# Altium schematic sheet top.SchDoc
size 420 x 297 mm; SheetNumber: 1; SheetTotal: 2
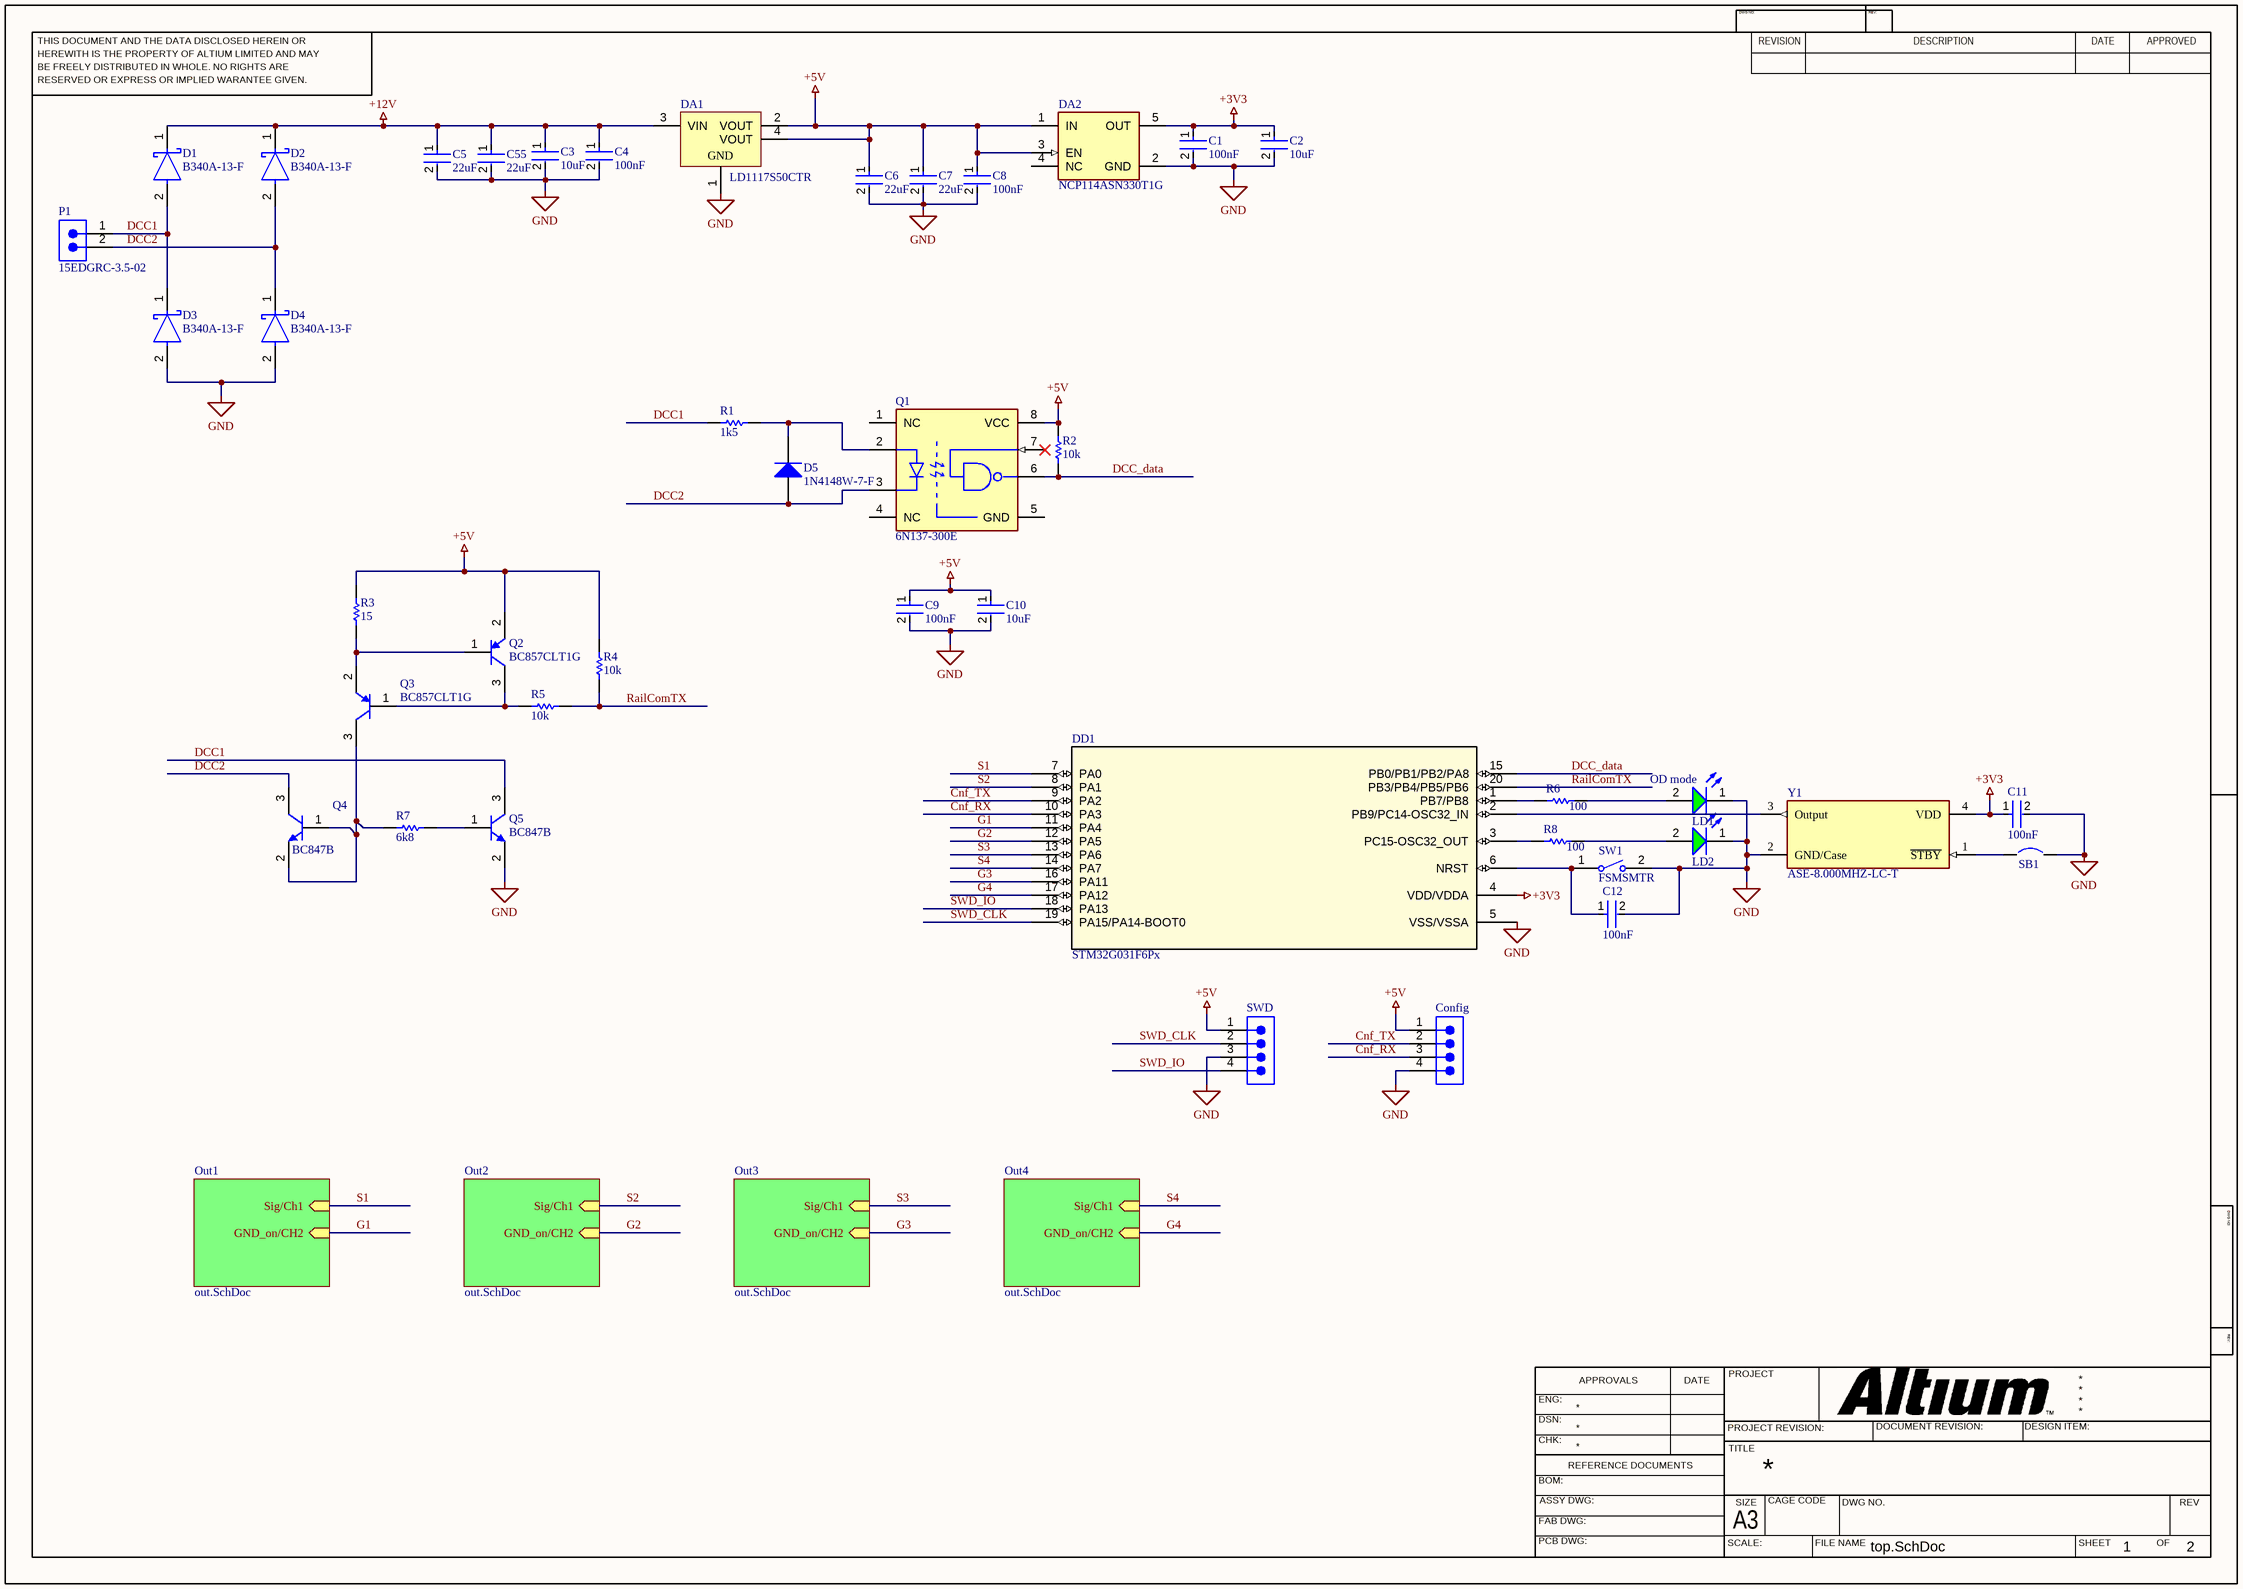
[diagram p0: top.SchDoc]

## Parts
C1  Capacitance: 100nF  [FP-CGA3E-0_3-0_1-IPC_C]  (hidden comment: CGA3E2X7R1H104K080AA)
C2  Capacitance: 10uF  [FP-GRM188-0_1-e0_2_0_55-IPC_C]  (hidden comment: GRM188R60J106ME47D)
C3  Capacitance: 10uF  [FP-GRM188-0_1-e0_2_0_55-IPC_C]  (hidden comment: GRM188R60J106ME47D)
C4  Capacitance: 100nF  [FP-CGA3E-0_3-0_1-IPC_C]  (hidden comment: CGA3E2X7R1H104K080AA)
C5  Capacitance: 22uF  [FP-GRM188-0_2-IPC_C]  (hidden comment: GRM188R61A226ME15D)
C6  Capacitance: 22uF  [FP-GRM188-0_2-IPC_C]  (hidden comment: GRM188R61A226ME15D)
C7  Capacitance: 22uF  [FP-GRM188-0_2-IPC_C]  (hidden comment: GRM188R61A226ME15D)
C8  Capacitance: 100nF  [FP-CGA3E-0_3-0_1-IPC_C]  (hidden comment: CGA3E2X7R1H104K080AA)
C9  Capacitance: 100nF  [FP-CGA3E-0_3-0_1-IPC_C]  (hidden comment: CGA3E2X7R1H104K080AA)
C10  Capacitance: 10uF  [FP-GRM188-0_1-e0_2_0_55-IPC_C]  (hidden comment: GRM188R60J106ME47D)
C11  Capacitance: 100nF  [FP-CGA3E-0_3-0_1-IPC_C]  (hidden comment: CGA3E2X7R1H104K080AA)
C12  Capacitance: 100nF  [FP-CGA3E-0_3-0_1-IPC_C]  (hidden comment: CGA3E2X7R1H104K080AA)
C55  Capacitance: 22uF  [FP-GRM188-0_2-IPC_C]  (hidden comment: GRM188R61A226ME15D)
Config  61300411121  [61300411121]  (value not drawn)
D1  B340A-13-F  [FP-SMA-MFG]
D2  B340A-13-F  [FP-SMA-MFG]
D3  B340A-13-F  [FP-SMA-MFG]
D4  B340A-13-F  [FP-SMA-MFG]
D5  1N4148W-7-F  [DIOD-SOD123-2_V]
DA1  LD1117S50CTR  [SOT-223_N]
DA2  NCP114ASN330T1G  [FP-483-MFG]
DD1  STM32G031F6Px  [TSSOP20]
LD1  150060VS75000  [WL-SMCW_0603_150060xx75000]  (value not drawn)
LD2  150060VS75000  [WL-SMCW_0603_150060xx75000]  (value not drawn)
P1  15EDGRC-3.5-02  [691305140002]
Q1  6N137-300E  [FP-6N137-300E-MFG]
Q2  BC857CLT1G  [ONSC-SOT-23-3-318-08_V]
Q3  BC857CLT1G  [ONSC-SOT-23-3-318-08_V]
Q4  BC847B  [INF-SOT23_M]
Q5  BC847B  [INF-SOT23_M]
R1  value 1k5  [RESC1608X55X25ML10T15]  (hidden comment: RC0603FR-071K5L)
R2  value 10k  [RESC1609X55X30NL15T15]  (hidden comment: ERJ3EKF1002V)
R3  value 15  [RESC1608X55X30NL15T15]  (hidden comment: ERJ-3EKF1502V)
R4  value 10k  [RESC1609X55X30NL15T15]  (hidden comment: ERJ3EKF1002V)
R5  value 10k  [RESC1609X55X30NL15T15]  (hidden comment: ERJ3EKF1002V)
R6  value 100  [RESC1608X55X30NL15T15]  (hidden comment: ERJ-3EKF1003V)
R7  value 6k8  [RESC1608X55X25NL10T15]  (hidden comment: RC0603FR-076K8L)
R8  value 100  [RESC1608X55X30NL15T15]  (hidden comment: ERJ-3EKF1003V)
SB1  (no value)  [JP_SMD]
SW1  FSMSMTR  [TECO-FSMSMTR_V]
SWD  61300411121  [61300411121]  (value not drawn)
Y1  ASE-8.000MHZ-LC-T  [FP-ASE-MFG]

## Sub-sheets
Out1 = out.SchDoc: Sig/Ch1 (in), GND_on/CH2 (in)
Out2 = out.SchDoc: Sig/Ch1 (in), GND_on/CH2 (in)
Out3 = out.SchDoc: Sig/Ch1 (in), GND_on/CH2 (in)
Out4 = out.SchDoc: Sig/Ch1 (in), GND_on/CH2 (in)

## Nets
+3V3: C1.1 C2.1 C11.1 DA2.5(OUT) DD1.4(VDD/VDDA) Y1.4(VDD)
+5V: C6.1 C7.1 C8.1 C9.1 C10.1 Config.1 DA1.2(VOUT) DA1.4(VOUT) DA2.1(IN) DA2.3(EN) Q1.8(VCC) Q2.2(E) R2.1 R3.2 R4.1 SWD.1
+12V: C3.1 C4.1 C5.1 C55.1 D1.1(C) D2.1(C) DA1.3(VIN)
GND: C1.2 C2.2 C3.2 C4.2 C5.2 C6.2 C7.2 C8.2 C9.2 C10.2 C11.2 C12.2 C55.2 Config.4 D3.2(A) D4.2(A) DA1.1(GND) DA2.2(GND) DD1.5(VSS/VSSA) LD1.1(K) LD2.1(K) Q5.2(E) SB1.2 SW1.2 SWD.3 Y1.2(GND/Case)
Cnf_RX: Config.3 DD1.10(PA3)
Cnf_TX: Config.2 DD1.9(PA2)
DCC1: D1.2(A) D3.1(C) P1.1 Q5.3(C) R1.1
DCC2: D2.2(A) D4.1(C) D5.1(A) P1.2 Q1.3(C) Q4.3(C)
DCC_data: DD1.15(PB0/PB1/PB2/PA8) Q1.6(VO) R2.2
G1: DD1.11(PA4) ; sheet Out1/GND_on/CH2
G2: DD1.12(PA5) ; sheet Out2/GND_on/CH2
G3: DD1.16(PA11) ; sheet Out3/GND_on/CH2
G4: DD1.17(PA12) ; sheet Out4/GND_on/CH2
RailComTX: DD1.20(PB3/PB4/PB5/PB6) R4.2 R5.1
S1: DD1.7(PA0) ; sheet Out1/Sig/Ch1
S2: DD1.8(PA1) ; sheet Out2/Sig/Ch1
S3: DD1.13(PA6) ; sheet Out3/Sig/Ch1
S4: DD1.14(PA7) ; sheet Out4/Sig/Ch1
SWD_CLK: DD1.19(PA15/PA14-BOOT0) SWD.2
SWD_IO: DD1.18(PA13) SWD.4
NetC12_1: C12.1 DD1.6(NRST) SW1.1
NetD5_2: D5.2(K) Q1.2(A) R1.2
NetDD1_1: DD1.1(PB7/PB8) R6.1
NetDD1_2: DD1.2(PB9/PC14-OSC32_IN) Y1.3(Output)
NetDD1_3: DD1.3(PC15-OSC32_OUT) R8.1
NetLD1_2: LD1.2(A) R6.2
NetLD2_2: LD2.2(A) R8.2
NetQ2_1: Q2.1(B) Q3.2(E) R3.1
NetQ2_3: Q2.3(C) Q3.1(B) R5.2
NetQ3_3: Q3.3(C) Q4.1(B) Q4.2(E) R7.1
NetQ5_1: Q5.1(B) R7.2
NetSB1_1: SB1.1 Y1.1(~{STBY})

Not connected (* = marked no-connect by the designer): DA2 4(NC); Q1 1(NC) 4(NC) 5(GND) 7(VE)*

## Notes on the sheet
- (near LD1) OD mode
- THIS DOCUMENT AND THE DATA DISCLOSED HEREIN OR
- HEREWITH IS THE PROPERTY OF ALTIUM LIMITED AND MAY
- DWG NO:
- REVISION
- REV:
- DESCRIPTION
- DATE
- APPROVED
- BE FREELY DISTRIBUTED IN WHOLE. NO RIGHTS ARE
- RESERVED OR EXPRESS OR IMPLIED WARANTEE GIVEN.
- ENG:
- APPROVALS
- PROJECT
- DSN:
- CHK:
- REFERENCE DOCUMENTS
- PROJECT REVISION:
- TITLE
- DOCUMENT REVISION:
- DESIGN ITEM:
- BOM:
- FAB DWG:
- PCB DWG:
- ASSY DWG:
- SCALE:
- A3
- SIZE
- CAGE CODE
- FILE NAME
- DWG NO.
- SHEET
- OF
- REV

## Library data of the parts
C1 C4 C8 C9 C11 C12 = CMP-2000-07546-2: Cap Ceramic 100nF 50V X7R 10% Pad SMD 0603 +125°C Automotive T/R; Weight: 7.1E-05oz; Composition: Ceramic; Max Operating Temperature: 125°C; Termination: SMD/SMT; Dielectric: X7R; Length: 1.6mm; Package Quantity: 1; REACH SVHC: No SVHC; Lead Free: Lead Free; Case Code (Metric): 1608; Min Operating Temperature: -55°C; Packaging: Tape and Reel; Tolerance: 10%; Voltage Rating: 50V; Case Code (Imperial): 0603; Case/Package: 0603; Voltage Rating (DC): 50V; Depth: 0.8mm; Radiation Hardening: No; Ratings: AEC-Q200; Mount: Surface Mount; Voltage: 50V; Thickness: 0.035inch; Width: 0.8mm; Height: 0.8mm
C2 C3 C10 = CMP-2006-02792-2: Chip Multilayer Ceramic Capacitors for General Purpose, 0603, 10uF, X5R, 15%, 20%, 6.3V; Packaging: Tape and Reel; Voltage Rating (DC): 6.3V; Width: 0.031inch; Termination: SMD/SMT; Dielectric: X5R; Package Quantity: 4000; Voltage Rating: 6.3V; Case/Package: 0603; Min Operating Temperature: -55°C; Voltage: 6.3V; Length: 1.6mm; Thickness: 0.035inch; Lead Free: Lead Free; Depth: 0.8mm; Case Code (Imperial): 0603; Max Operating Temperature: 85°C; Material: Ceramic; Height: 0.8mm; Tolerance: 20%; Mount: Surface Mount; REACH SVHC: No SVHC; Radiation Hardening: No; Case Code (Metric): 1608
C5-C7 C55 = CMP-2000-06337-3: Chip Multilayer Ceramic Capacitors for General Purpose, 0603, 22uF, X5R, 15%, 20%, 10V; Tolerance: 20%; Weight: 0.000222oz; Material: Ceramic; Depth: 0.8mm; Length: 1.6mm; Termination: SMD/SMT; Packaging: Tape and Reel; Width: 0.8mm; Voltage Rating: 10V; Case Code (Imperial): 0603; Mount: Surface Mount; Voltage Rating (DC): 10V; Case/Package: 0603; Thickness: 0.039inch; REACH SVHC: No SVHC; Dielectric: X5R; Height: 0.8mm; Package Quantity: 4000; Case Code (Metric): 1608; Min Operating Temperature: -55°C; Lead Free: Lead Free; Max Operating Temperature: 85°C
Config SWD = CMP-1502-01064-3: NexarPartId: 32855522; Operating Supply Voltage: 250V; Pitch: 2.54mm; Contact Resistance: 20mΩ; Number of Positions: 4; Current Rating: 3A; Connector Type: Male Pin; Gender: Male; Contact Plating: Gold; Height: 8.89mm; Lead Pitch: 2.54mm; Lead Free: Lead Free; Contact Mating Length: 5.9944mm; Number of Rows: 1; Termination: Solder; Packaging: Bulk; REACH SVHC: Unknown; Min Operating Temperature: -40°C; RoHS: Compliant; Number of Contacts: 4; Voltage Rating: 250V; Color: Black; Max Operating Temperature: 105°C; Contact Material: Copper; Mount: Through Hole; Orientation: Vertical; Number of Pins: 4
D1-D4 = CMP-1667-00003-3: DIODE SCHOTTKY 40V 3A SMA; Max Forward Surge Current (Ifsm): 80A; Forward Voltage: 500mV; Polarity: Standard; Max Reverse Current: 500uA; Capacitance: 250pF; Element Configuration: Single; Mount: Surface Mount; Output Current: 3A; Radiation Hardening: No; Width: 2.92mm; Current Rating: 3A; Termination: SMD/SMT; Voltage: 40V; Series: -; Max Operating Temperature: 125°C; Current: 3A; Max Repetitive Reverse Voltage (Vrrm): 40V; Min Operating Temperature: -55°C; REACH SVHC: No SVHC; Number of Pins: 2; Average Rectified Current: 3A; Contact Plating: Tin; RoHS Compliant: Yes; Max Reverse Voltage (DC): 40V; Packaging: Tape and Reel; Height: 2.3mm; Length: 4.6mm; Case/Package: SMA; Weight: 0.002258oz; Peak Non-Repetitive Surge Current: 80A; Package Quantity: 5000; Lead Free: Lead Free; Forward Current: 3A; Voltage Rating (DC): 40V
D5 = CMP-2000-04932-2: Fast Switching Diode, 100 V, 0.15 A, -65 to 150 degC, 2-Pin?SOD123, RoHS, Tape and Reel; Recovery Time: 4ns; Brand: DiodesIncorporated; Unit Weight: 0.000353oz; Max Surge Current: 2A; Peak Reverse Voltage: 100V; Ir - Reverse Current: 1uA; Vf - Forward Voltage: 1.25V; Configuration: Single; If - Forward Current: 0.15A; Product Category: Diodes-GeneralPurpose,Power,Switching; Operating Temperature Range: -65Cto+150C; Packaging: Reel; Manufacturer URL: http://www.diodes.com/; Maximum Operating Temperature: +150C; Height: 1.25mm; Minimum Operating Temperature: -65C; Product: SwitchingDiodes; Package URL: http://www.diodes.com/datasheets/ds18004.pdf; Type: SwitchingDiode; Package Reference: SOD123-2; Width: 1.7mm; Datasheet URL: http://www.farnell.com/datasheets/1915529.pdf; Datasheet Version: Rev. 24-2, 10/2013; Series: 1N4148; Factory Pack Quantity: 3000; Length: 2.85mm; RoHS: True; Manufacturer: DiodesIncorporated; Mounting Style: SMD/SMT; Package / Case: SOD-123
DA1 = CMP-0244-00311-1: Fixed Low Drop Positive Voltage Regulator, 5V, 4-Pin SOT-223, Tape and Reel; PackageReference: SOT-223; PackageVersion: 2010; ComponentLink2URL: http://www.st.com/internet/com/TECHNICAL_RESOURCES/TECHNICAL_LITERATURE/DATASHEET/CD00000544.pdf; ComponentLink1URL: http://www.st.com; ComponentLink2Description: Datasheet; DatasheetVersion: 1/11/2011; ComponentLink1Description: Manufacturer URL; PackageDescription: 4-Pin SOT-223 Package, 6.5 x 3.5 mm Body, 2.3 mm Pitch, 7 mm Lead Span
DA2 = CMP-07128-000001-1: IC REG LINEAR 3.3V 300MA 5TSOP; Manufacturer: ON Semiconductor; Dropout Voltage: 150mV; Number Of Outputs: 1; Output Type: Fixed; Standoff Height: 0.01mm; Nominal Supply Current: 50uA; Accuracy Percentage: 1%; Max Junction Temp: +150°C; Min Supply Voltage: 1.7V; Max Supply Voltage: 5.5V; Output Voltage: 3.3V; Device Class L2: Power Management ICs; Digikey Description: IC REG LINEAR 3.3V 300MA 5TSOP; Footprint Url: https://www.onsemi.com/pub/Collateral/483.PDF; Temperature: to +150°C; RoHS: TRUE; Octopart: https://octopart.com/ncp114asn330t1g-on+semiconductor-74628742; Package: 483; Height: 1.1mm; Device Class L1: Integrated Circuits (ICs); Device Class L3: Voltage Regulators - Linear; ComponentLink2URL: https://www.onsemi.com/pub/Collateral/NCP114-D.PDF; Output Current: 300mA; Automotive: No; ComponentLink2Description: Datasheet; Manufacturer Part Number: NCP114ASN330T1G; Category: IC; Lead Free: Yes; Temperature Range High: +150°C
DD1 = STM32G031F6Px: The STM32G031x4/x6/x8 mainstream microcontrollers are based on high-performance Arm® Cortex®-M0+ 32-bit RISC core operating at up to 64 MHz frequency. / 32 Kbytes of Flash program memory and 8 Kbytes of SRAM. With 20pin TSSOP 6.4x4.4 package; Manufacturer_Part_Number: stm32g0_tssop20_t1; Vendor: STMicroelectronics; Copyright: Copyright (C) 2018 Accelerated Designs. All rights reserved; RefDes: RefDes; Type: DEV; Value: Value
LD1 LD2 = CMP-1426-00006-7: WURTH ELEKTRONIK - 150060VS75000 - LED, Green, SMD, 0603, 30 mA, 2 V, 570 nm; Reverse Voltage: 5V; Power Dissipation: 72mW; Dominant Wavelength: 570nm; Peak Wavelength: 572nm; Forward Current: 100mA; Forward Voltage: 2V; Lens Style: Clear, Rectangular; Test Current: 20mA; Max Junction Temperature (Tj): 95°C; Viewing Angle: 140°; Luminous Intensity: 40mcd; Height: 700µm; Width: 800µm; Length: 1.6mm; Mount: Surface Mount; Min Operating Temperature: -40°C; Max Reverse Voltage (DC): 5V; Case Code (Imperial): 0603; Wavelength: 570nm; Color: Green; REACH SVHC: Unknown; RoHS: Compliant; Max Operating Temperature: 85°C; Packaging: Tape and Reel; Case/Package: 0603; Number of Pins: 2; Case Code (Metric): 1608
P1 = CMP-1502-01775-2: NexarPartId: 78871375; Gender: Male; Number of Pins: 2; Packaging: Box; RoHS: Non-Compliant; Lead Pitch: 3.5mm
Q1 = CMP-18400-000015-1: OPTOISO 3.75KV OPN COLL 8DIP GW; Manufacturer: Broadcom; Min Supply Voltage: 4.5V; Forward Voltage: 1.5V; Turn Off Delay Time: 50ns; Standoff Height: 0.505mm; Reverse Voltage: 5V; Isolation Voltage: 3750Vrms; Forward Current: 10mA; Turn On Delay Time: 48ns; Max Supply Voltage: 5.5V; Package: 0; Automotive: No; Lead Free: Yes; ComponentLink2Description: Datasheet; Temperature: -40°C to +85°C; Device Class L3: unset; Height: 4.455mm; Ambient Temperature Range Low: -40°C; Digikey Description: OPTOISO 3.75KV OPN COLL 8DIP GW; Temperature Range Low: -40°C; ComponentLink2URL: https://docs.broadcom.com/docs/AV02-0940EN; Mouser Description: High Speed Optocouplers 10 Mb/s 3750Vrms; Category: Trans; Ambient Temperature Range High: +85°C; RoHS: TRUE; Octopart: https://octopart.com/6n137-300e-broadcom-71125550; Manufacturer Part Number: 6N137-300E; Device Class L1: Optoelectronics; Device Class L2: Optocouplers; Temperature Range High: +85°C
Q2 Q3 = CMP-1048-00802-1: General Purpose Transistor, PNP Silicon, 3-Pin SOT-23, Pb-Free, Tape and Reel; Manufacturer: On Semiconductor; IC Continuous (A): -0.1; fT Min (MHz): 100; Polarity: PNP; PackageReference: SOT-23-3-318-08; ComponentLink3Description: Package Specification; ComponentLink2Description: Datasheet; PackageDescription: 3-Pin Small Outline Transistor, Body 2.92 x 1.3 mm, Pitch 0.95 mm; PackageVersion: Rev. AP, 11/2009; ComponentLink1Description: Manufacturer URL; PartNumber: BC857CLT1G; ComponentLink2URL: http://www.onsemi.cn/pub_link/Collateral/BC856ALT1-D.PDF; ComponentLink1URL: http://www.onsemi.com/; ComponentLink3URL: http://www.onsemi.cn/pub_link/Collateral/318-08.PDF; RoHS: TRUE; Packing: Tape and Reel; Mounting Technology: Surface Mount; DatasheetVersion: Rev. 13
Q4 Q5 = CMP-1177-00042-1: NPN Silicon AF Transistor, 45 V VCEO, 100 mA IC, SOT23, Reel, Green; Manufacturer: Infineon; VEBO (max): 6Â V; ICBO (max): 15Â nA; VCBO (max): 50Â V; IBM (max): 200Â mA; Green: TRUE; Ptot (max): 330Â mW; fT (typ): 250Â MHz; IC (max): 100Â mA; VCEO (max): 45Â V; PackageDescription: 3-Pin Small Outline Transistor Package, 1.3 x 2.9 mm Body, 0.95 mm Pitch; ComponentLink3URL: http://www.infineon.com/dgdl/SOT23-Package_Overview.pdf?folderId=db3a30431936bc4b0119532290053c66&fileId=db3a30431936bc4b0119533468123c85; PackageVersion: Apr-08; Packing: Reel; ComponentLink3Description: Package Specification; ComponentLink2URL: http://www.infineon.com/dgdl/bc847series_bc848series_bc849series_bc850series.pdf?folderId=db3a304314dca389011541d30fa21656&fileId=db3a304314dca389011541d4630a1657; ComponentLink1URL: http://www.infineon.com/; ComponentLink2Description: Datasheet; Polarity: NPN; Mounting Technology: Surface Mount; PackageReference: SOT23; ICM (max): 200Â mA; ComponentLink1Description: Manufacturer URL; PartNumber: BC847B
R1 = CMP-2100-03665-1: Chip Resistor, 1.5 KOhm, +/- 1%, 0.1 W, -55 to 155 degC, 0603 (1608 Metric), RoHS, Tape and Reel; Manufacturer: Yageo; Power Rating: 100mW; Voltage Rating: 50V; Temperature Coefficient: 100ppm/degreesC; Military Standard: Not; Datasheet URL: http://www.yageo.com/NewPortal/yageodocoutput?fileName=/pdf/R-Chip/PYu-RC_Group_51_RoHS_L_5.pdf; Package Description: 2-Pin Surface Mount Device, Body 1.6 x 0.8 mm; Composition: ThickFilm; Case Code (Metric): 1608; Case/Package: 0603; Number of Terminations: 2; Depth: 0.8mm; Height: 0.022inch; Manufacturer URL: http://www.yageo.com/; Lead Free: LeadFree; Min Operating Temperature: -55degC; Max Operating Temperature: 155degC; Datasheet Version: Rev. 5, 10/2016; RoHSCompliant: true; Max Power Dissipation: 100mW; Packaging: TapeandReel; Voltage Rating (DC): 50V; Length: 0.063inch; Tolerance: 1%; Width: 0.031inch; Number of Pins: 2; Termination: SMD/SMT; Package Reference: 0603; Package Quantity: 1; Case Code (Imperial): 0603; Resistance: 1.5KOhm; REACH SVHC: NoSVHC
R2 R4 R5 = CMP-1012-00623-3: Chip Resistor, 10 KOhm, +/- 1%, 0.1 W, -55 to 155 degC, 0603 (1608 Metric), RoHS, Tape and Reel; Manufacturer: Panasonic; Voltage Rating: 75V; Case\/Package: 0603; Power Rating: 100mW; Resistance: 10KOhm; Temperature Coefficient: 100ppm\/degreesC; Number of Pins: 2; Package Reference: 603; Depth: 0.8mm; Mount: SurfaceMount; Package Description: 2-Pin Surface Mount Device, Body 1.6 x 0.85 mm; Datasheet Version: 02/2017; Length: 1.6mm; Lead Free: LeadFree; Height: 0.45mm; Number of Terminations: 2; Max Power Dissipation: 100mW; Min Operating Temperature: -55degC; Datasheet URL: https://industrial.panasonic.com/cdbs/www-data/pdf/RDA0000/AOA0000C304.pdf; Termination: SMD/SMT; Case Code (Metric): 1608; Case Code (Imperial): 0603; Tolerance: 1%; Max Operating Temperature: 155degC; RoHSCompliant: true; Voltage Rating (DC): 75V; Radiation Hardening: No; Packaging: TapeandReel; Composition: ThickFilm; Mounting Technology: SurfaceMount; Manufacturer URL: http://www.panasonic.com/; Width: 0.031inch; REACH SVHC: NoSVHC; Contact Plating: Tin; Military Standard: Not; Package Quantity: 1
R3 = CMP-2000-00258-1: Manufacturer: Panasonic; Part Number: ERJ-3EKF1502V
R6 R8 = CMP-2000-00182-1: Manufacturer: Panasonic; Part Number: ERJ-3EKF1003V
R7 = CMP-1659-00046-1: Chip Resistor, 6.8 KOhm, +/- 1%, 100 mW, -55 to 155 degC, 0603 (1608 Metric), RoHS, Tape and Reel; Shielding: Unshielded; Gender: Female; Current Rating: 2 A; Case\Package: Metal; Voltage Rating: 34 V; Colour: Black; ComponentLink2URL: http://www.yageo.com/documents/recent/PYu-RC_Group_51_RoHS_L_04.pdf; REACH SVHC: Unknown; Package Quantity: 1; Height: 13 mm; Contact Material: Copper; ComponentLink1Description: Manufacturer URL; Min Operating Temperature: -25 degC; RoHSCompliant: true; ComponentLink2Description: Datasheet; PackageReference: 0603; Length: 19.5 mm; Pins: 1; Contact Plating: Silver; PackageDescription: 2-Pin Surface Mount Device, Body 1.6 x 0.8 mm; Max Operating Temperature: 85 degC; Mount: Through Hole; DatasheetVersion: Rev. 4, 02/2016; Width: 10 mm; ComponentLink1URL: http://www.yageo.com/
SB1 = Circuit Breaker: Solder: NO; Published: 24-Mar-1999; Revision: July-2002: Re-released for DXP Platform.; Publisher: Altium Limited
SW1 = CMP-2000-07501-1: FSMSM Push Button Switch, 50 mA, -35 to 85 degC, 2-Pin SMD, RoHS, Tape and Reel; Manufacturer: TE Connectivity; Voltage Rating (DC): 24V; Electrical Life: 20000Cycles; Operating Force: 180gf; Switch Travel: 0.25mm; Contact Current Rating: 50mA; Case\/Package: SMD/SMT; Actuator Length: 1.07mm; Throw Configuration: SPST; Actuator Material: Polyamide; Contact Resistance: 100mOhm; Illumination Type: Illuminated; Max Voltage Rating (DC): 12V; Manufacturer URL: http://www.te.com/; Lead Free: LeadFree; Packaging: TapeandReel; Min Operating Temperature: -35degC; Mechanical Life: 20000Cycles; Mount: SurfaceMount; REACH SVHC: Unknown; Package Quantity: 1800; Package Reference: FSMSMTR; RoHSCompliant: true; Max Operating Temperature: 85degC; Orientation: Straight; ELV: Compliant; Datasheet URL: http://www.te.com/commerce/DocumentDelivery/DDEController?Action=showdoc&DocId=Customer+Drawing%7F1437566-3%7FC2%7Fpdf%7FEnglish%7FENG_CD_1437566-3_C2_1437566_3_1_c.dwg.pdf%7F1437566-4; Package Description: 2-Pin Surface Mount Device, Body 6 x 3.5 mm, Pitch 9.19 mm; Current Rating: 50mA; Contact Plating: Silver; Termination: GullWing; Datasheet Version: Rev. C2, 08/2014; Contact Material: Brass; Mounting Technology: SurfaceMount
Y1 = CMP-27762-006944-1: XTAL Oscillator 8MHz ±50ppm CMOS 3.3V 4-SMD 3.2mm x 2.5mm; Max Supply Current: 7mA; Max Supply Voltage: 3.465V; Min Supply Voltage: 3.135V; Load Capacitance: 15pF; Length: 3.2mm; REACH SVHC: No SVHC; Operating Supply Voltage: 3.3V; Frequency Stability: 50ppm; Height: 0.047inch; Width: 0.098inch; Number of Pins: 4; Package Quantity: 1000; Min Operating Temperature: -40°C; Operating Frequency: 8 MHz; Termination: SMD/SMT; Max Operating Temperature: 85°C; Frequency: 8MHz; Radiation Hardening: No; Depth: 2.5mm; Case/Package: SMD/SMT; Packaging: Tape and Reel; Mount: Surface Mount; Series: ASE; Lead Free: Lead Free